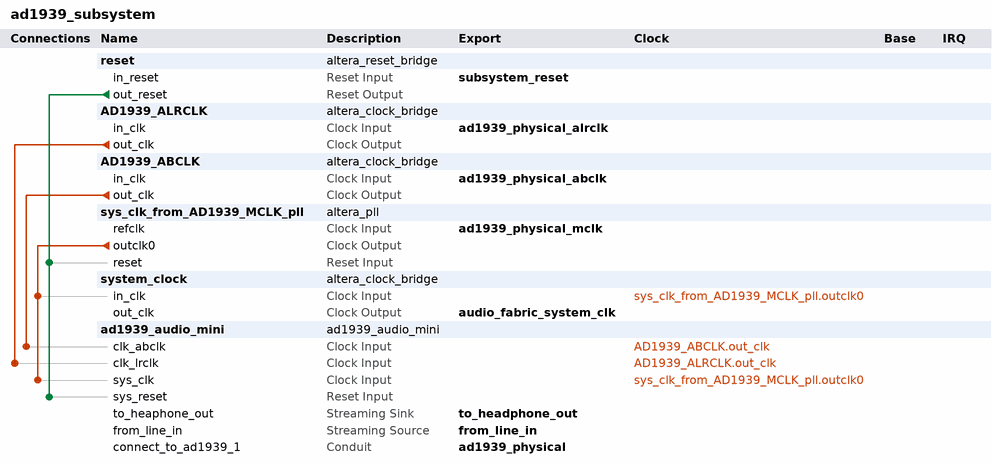
[diagram p0: system contents]
# Platform Designer (Qsys) system ad1939_subsystem, Cyclone V 5CSEBA6U23I7
# Parameters at their usual value, and those the tool derives, are not listed.
package require -exact qsys 21.1
create_system ad1939_subsystem
set_project_property DEVICE_FAMILY {Cyclone V}
set_project_property DEVICE 5CSEBA6U23I7

add_instance reset altera_reset_bridge 21.1
set_instance_parameter_value reset ACTIVE_LOW_RESET 0
set_instance_parameter_value reset SYNCHRONOUS_EDGES none

add_instance AD1939_ALRCLK altera_clock_bridge 21.1
set_instance_parameter_value AD1939_ALRCLK DERIVED_CLOCK_RATE 0
set_instance_parameter_value AD1939_ALRCLK EXPLICIT_CLOCK_RATE 192000

add_instance AD1939_ABCLK altera_clock_bridge 21.1
set_instance_parameter_value AD1939_ABCLK DERIVED_CLOCK_RATE 0
set_instance_parameter_value AD1939_ABCLK EXPLICIT_CLOCK_RATE 12288000

add_instance sys_clk_from_AD1939_MCLK_pll altera_pll 21.1
set_instance_parameter_value sys_clk_from_AD1939_MCLK_pll gui_device_speed_grade 1
set_instance_parameter_value sys_clk_from_AD1939_MCLK_pll gui_number_of_clocks 1
set_instance_parameter_value sys_clk_from_AD1939_MCLK_pll gui_operation_mode direct
set_instance_parameter_value sys_clk_from_AD1939_MCLK_pll gui_output_clock_frequency0 98.304
set_instance_parameter_value sys_clk_from_AD1939_MCLK_pll gui_pll_mode {Integer-N PLL}
set_instance_parameter_value sys_clk_from_AD1939_MCLK_pll gui_reference_clock_frequency 12.288
set_instance_parameter_value sys_clk_from_AD1939_MCLK_pll gui_use_locked false

add_instance system_clock altera_clock_bridge 21.1
set_instance_parameter_value system_clock DERIVED_CLOCK_RATE 98304000
set_instance_parameter_value system_clock EXPLICIT_CLOCK_RATE 0

add_instance ad1939_audio_mini ad1939_audio_mini 1.0

# connections
add_connection AD1939_ABCLK.out_clk ad1939_audio_mini.clk_abclk clock
add_connection AD1939_ALRCLK.out_clk ad1939_audio_mini.clk_lrclk clock
add_connection sys_clk_from_AD1939_MCLK_pll.outclk0 ad1939_audio_mini.sys_clk clock
add_connection sys_clk_from_AD1939_MCLK_pll.outclk0 system_clock.in_clk clock
add_connection reset.out_reset ad1939_audio_mini.sys_reset reset
add_connection reset.out_reset sys_clk_from_AD1939_MCLK_pll.reset reset

# exported interfaces
add_interface ad1939_physical conduit end
set_interface_property ad1939_physical EXPORT_OF ad1939_audio_mini.connect_to_ad1939_1
add_interface ad1939_physical_abclk clock sink
set_interface_property ad1939_physical_abclk EXPORT_OF AD1939_ABCLK.in_clk
add_interface ad1939_physical_alrclk clock sink
set_interface_property ad1939_physical_alrclk EXPORT_OF AD1939_ALRCLK.in_clk
add_interface ad1939_physical_mclk clock sink
set_interface_property ad1939_physical_mclk EXPORT_OF sys_clk_from_AD1939_MCLK_pll.refclk
add_interface audio_fabric_system_clk clock source
set_interface_property audio_fabric_system_clk EXPORT_OF system_clock.out_clk
add_interface from_line_in avalon_streaming source
set_interface_property from_line_in EXPORT_OF ad1939_audio_mini.from_line_in
add_interface subsystem_reset reset sink
set_interface_property subsystem_reset EXPORT_OF reset.in_reset
add_interface to_headphone_out avalon_streaming sink
set_interface_property to_headphone_out EXPORT_OF ad1939_audio_mini.to_heaphone_out

set_interconnect_requirement {$system} qsys_mm.clockCrossingAdapter HANDSHAKE
set_interconnect_requirement {$system} qsys_mm.enableEccProtection FALSE
set_interconnect_requirement {$system} qsys_mm.insertDefaultSlave FALSE
set_interconnect_requirement {$system} qsys_mm.maxAdditionalLatency 1

save_system ad1939_subsystem.qsys
